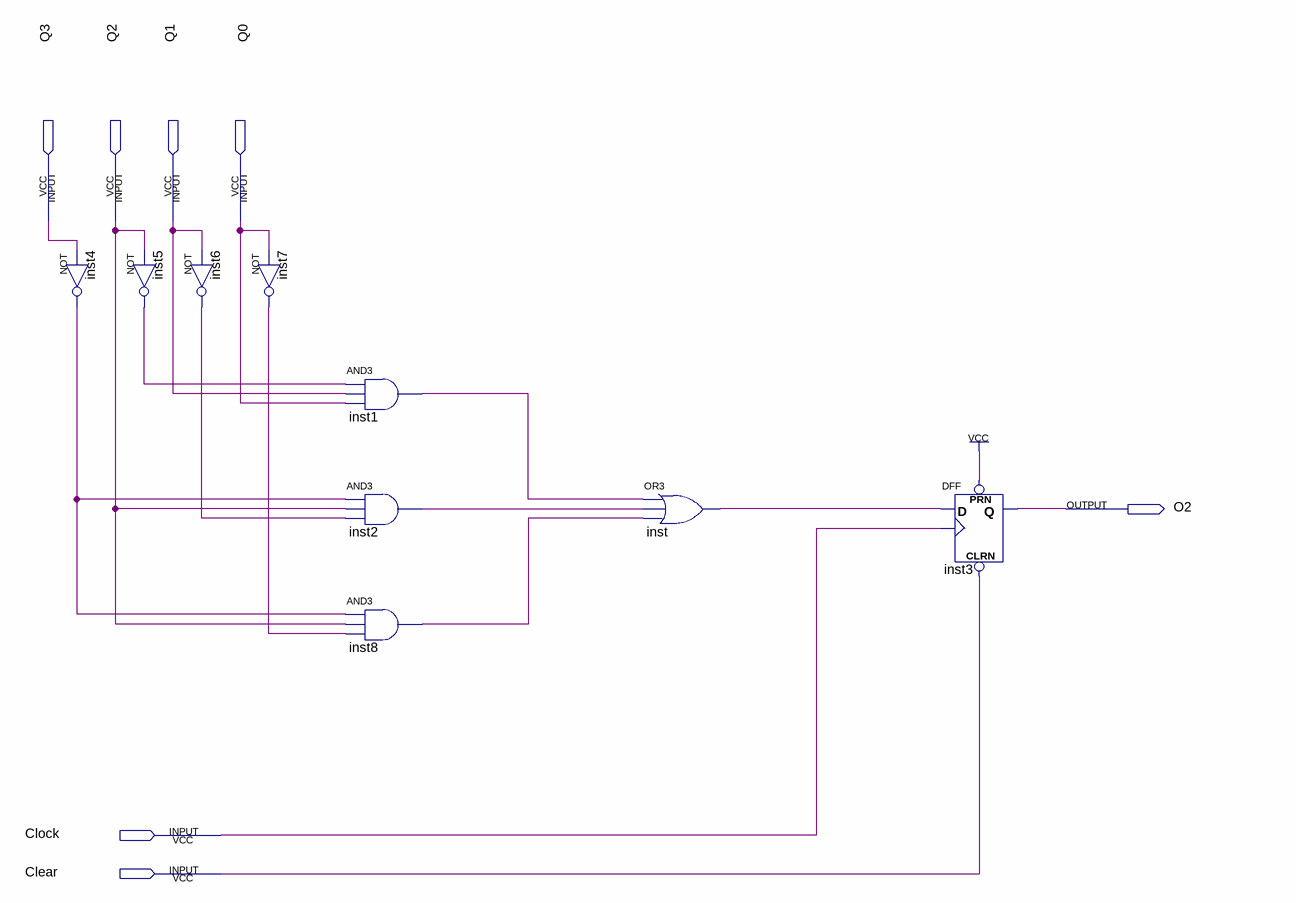
[diagram p0: schematic sheet]
// Quartus schematic 0CD2.bdf as structural Verilog: 9 symbols, 7 pins
module \0CD2  (
  input  Q3,
  input  Q2,
  input  Q1,
  input  Q0,
  input  Clock,
  input  Clear,
  output O2
);

  wire inst1_out, inst2_out, inst4_out, inst5_out, inst6_out, inst7_out, inst8_out, inst_out;

  not inst4 (inst4_out, Q3);
  not inst5 (inst5_out, Q2);
  not inst6 (inst6_out, Q1);
  not inst7 (inst7_out, Q0);
  and inst1 (inst1_out, inst5_out, Q1, Q0);
  and inst2 (inst2_out, inst4_out, Q2, inst6_out);
  and inst8 (inst8_out, inst4_out, Q2, inst7_out);
  or inst (inst_out, inst1_out, inst2_out, inst8_out);
  DFF inst3 (.CLRN(Clear), .CLK(Clock), .D(inst_out), .PRN(1'b1), .Q(O2));
endmodule
